# EasyEDA Pro project 支架带LED板_倒.eprj

# Schematic Schematic1
Create Date: 2024-05-26; Page Name: P1; Project Name: 支架带LED板_倒; Schematic Name: Schematic1; Update Date: 2024-05-27; Company: 嘉立创EDA; Page Size: A4; Version: V1.0
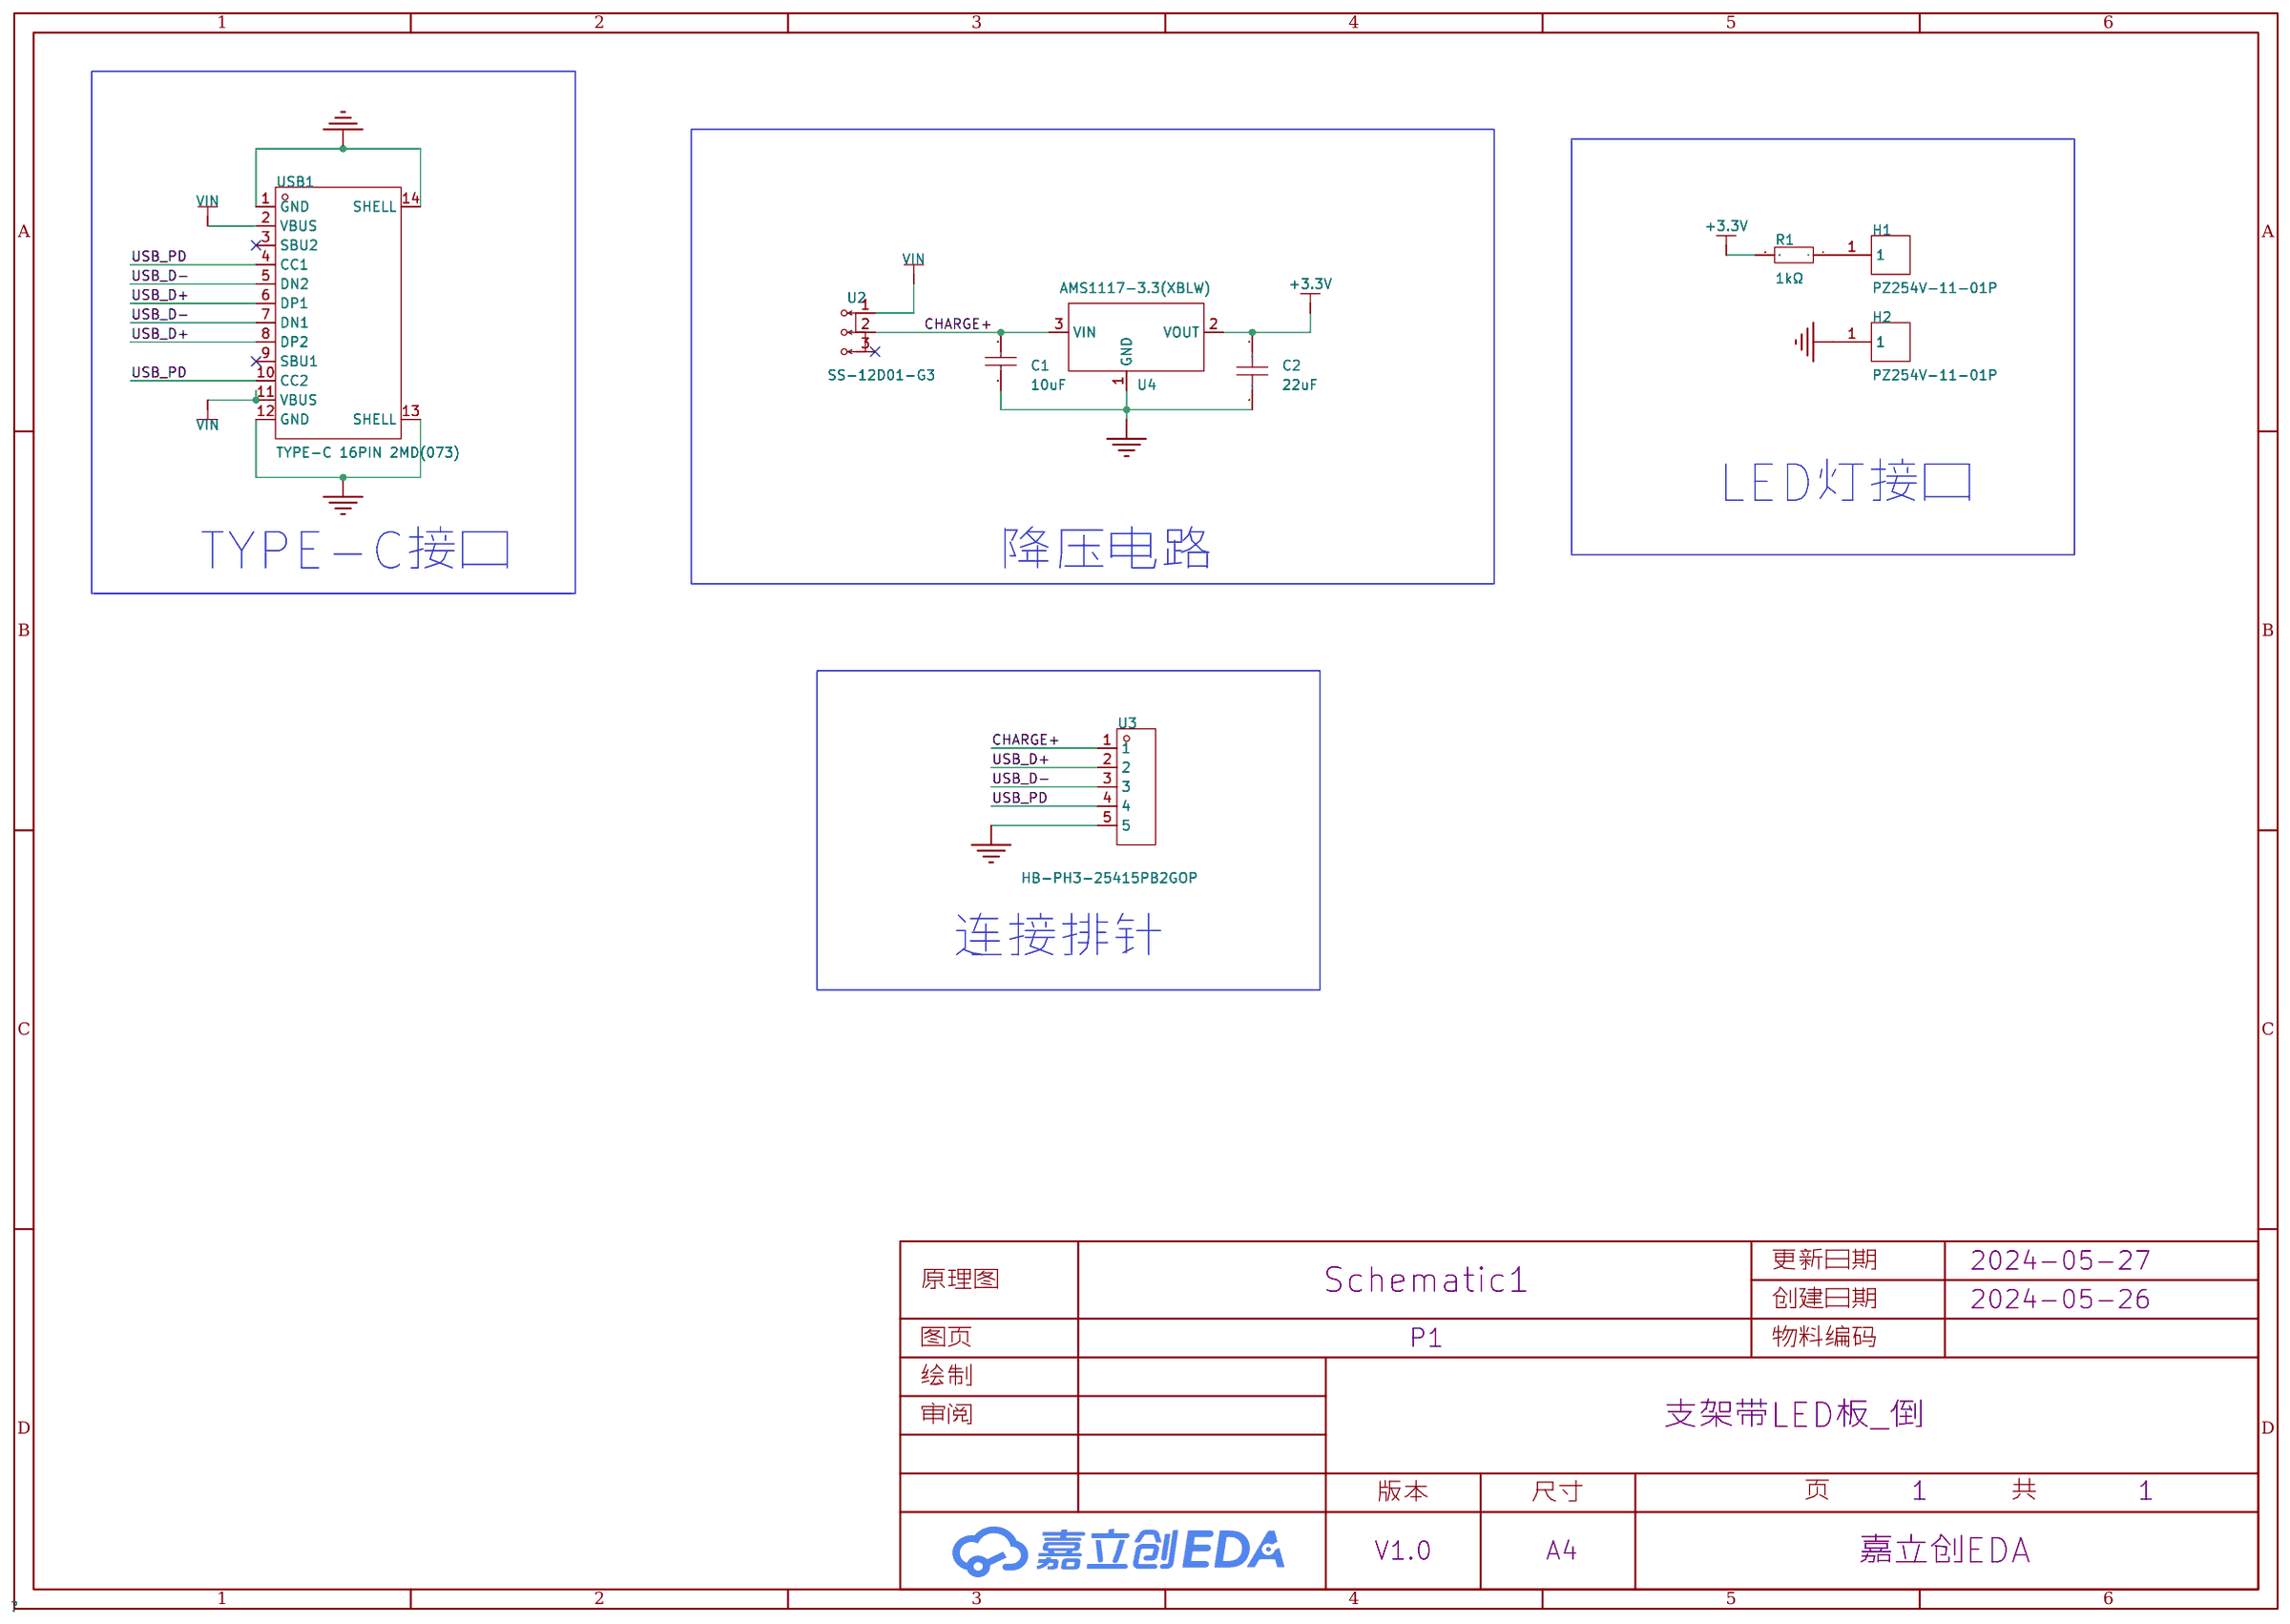
[diagram p0: schematic sheet]

## Parts
C1  10uF  [C1210]
C2  22uF  [C0603]
H1  PZ254V-11-01P  [HDR-TH_1P-P2.54-V-M]
H2  PZ254V-11-01P  [HDR-TH_1P-P2.54-V-M]
R1  1kΩ  [R0805]
U2  SS-12D01-G3  [SW-TH_DEALON_SS-12D01-GX]
U3  HB-PH3-25415PB2GOP  [HDR-TH_5P-P2.54-V-M]
U4  AMS1117-3.3(XBLW)  [SOT-89-3_L4.5-W2.5-P1.50-LS4.2-BR]
USB1  TYPE-C 16PIN 2MD(073)  [USB-C-SMD_TYPE-C-6PIN-2MD-073]

## Library data of the parts
C1 = 1210B106K500NT_C116808: 容值:10uF;精度:±10%;额定电压:50V;材质(温度系数):X7R;; LCSC Part Name: 10uF ±10% 50V; Supplier Part: C116808; Manufacturer: FH(风华); Manufacturer Part: 1210B106K500NT; Supplier Footprint: 1210; JLCPCB Part Class: 扩展库; Datasheet: https://atta.szlcsc.com/upload/public/pdf/source/20200305/C486355_26A10D38EF8C2A5C37091D0039909270.pdf; Supplier: LCSC; Tolerance: ±10%; Voltage Rated: 50V; Temperature Coefficient: X7R
C2 = CL10A226MQ8NRNC: 容值:22uF;精度:±20%;额定电压:6.3V;材质(温度系数):X5R;; LCSC Part Name: 22uF ±20% 6.3V; Supplier Part: C59461; Manufacturer: SAMSUNG(三星); Supplier Footprint: 0603; JLCPCB Part Class: 基础库; Datasheet: https://atta.szlcsc.com/upload/public/pdf/source/20160218/1457707763339.pdf; Supplier: LCSC; Tolerance: ±20%; Voltage Rated: 6.3V; Temperature Coefficient: X5R
H1 H2 = PZ254V-11-01P: 插针结构:1x1P;间距:2.54mm;行距:-;圆针/方针:方针;安装类型:直插;排数:单排;总PIN位数:1P;额定电流:-;额定电压:-;配合针长度:6mm;塑高:2.5mm;端接针长度:3mm;触头材质:黄铜;触头镀层:-;工作温度范围:-40℃~+105℃;颜色:黑色;; LCSC Part Name: 间距:2.54mm 1x1P 直插 方针; Supplier Part: C492400; Manufacturer: XFCN(兴飞); Supplier Footprint: 插件,P=2.54mm; JLCPCB Part Class: 扩展库; Datasheet: https://atta.szlcsc.com/upload/public/pdf/source/20200309/C492400_46876A5B545F5AE6B8D4A09C46E276E8.pdf; Supplier: LCSC; Pin Structure: 1x1P; Pitch: 2.54mm; Circluar Pins/Square Pins: 方针; Mounting Type: 直插; Number of Rows: 单排; Number of Pins: 1P; Length of Mating Pin: 6mm; Insulation Height: 2.5mm; Length of End Connection Pin: 3mm; Contact Material: 黄铜; Operating Temperature Range: -40℃~+105℃; Color: 黑色
R1 = RC0805FR-071KL: 电阻类型:厚膜电阻;阻值:1kΩ;精度:±1%;功率:125mW;最大工作电压:150V;温度系数:±100ppm/℃;; LCSC Part Name: 厚膜电阻 1kΩ ±1% 125mW; Supplier Part: C95781; Manufacturer: YAGEO(国巨); Supplier Footprint: 0805; JLCPCB Part Class: 扩展库; Datasheet: https://atta.szlcsc.com/upload/public/pdf/source/20170708/1499509500945.pdf; Supplier: LCSC; Type: 厚膜电阻; Tolerance: ±1%; Power(Watts): 125mW; Overload Voltage (Max): 150V; Temperature Coefficient: ±100ppm/℃; Operating Temperature Range: -55℃~+155℃
U2 = SS-12D01-G3_C2998803: 电路结构:单刀双掷;安装方式:直插;开关颜色:黑色;机械寿命:-;; Supplier Part: C2998803; Manufacturer: DEALON(德艺隆); Supplier Footprint: 插件; JLCPCB Part Class: 扩展库; Datasheet: https://atta.szlcsc.com/upload/public/pdf/source/20220425/25A884465C8B20C5829C01117852840B.pdf; Supplier: LCSC; Circuit: 单刀双掷; Actuator Style: 矩形柱状; Pin Style: PC引脚; Switch Length: 8.5mm; Switch Width: 3.8mm; Mounting Style: 直插; Actuator Color: 黑色
U3 = HB-PH3-25415PB2GOP: 插针结构:1x5P;间距:2.54mm;行距:2.54mm;圆针/方针:方针;安装类型:直插;排数:单排;总PIN位数:5P;额定电流:3A;额定电压:250V;配合针长度:6mm;塑高:2.54mm;端接针长度:3mm;触头材质:黄铜;触头镀层:金;工作温度范围:-40℃~+105℃;焊接温度(最大值):260℃;颜色:黑色;; LCSC Part Name: 间距:2.54mm 1x5P 直插 方针; Supplier Part: C6332198; Manufacturer: HANBO(汉博); Supplier Footprint: 插件,P=2.54mm; JLCPCB Part Class: 扩展库; Datasheet: https://atta.szlcsc.com/upload/public/pdf/source/20230803/F72D259687963761DF1B552F3BB84A31.pdf; Supplier: LCSC; Pin Structure: 1x5P; Pitch: 2.54mm; Row Spacing: 2.54mm; Circluar Pins/Square Pins: 方针; Mounting Type: 直插; Number of Rows: 单排; Number of Pins: 5P; Current Rating (Max): 3A; Voltage Rating (Max): 250V; Length of Mating Pin: 6mm; Insulation Height: 2.54mm; Length of End Connection Pin: 3mm; Contact Material: 黄铜; Contact Plating: 金; Operating Temperature Range: -40℃~+105℃; Soldering Temperature(Max): 260℃; Color: 黑色
U4 = AMS1117-3.3(XBLW): 最大输入电压:15V;最大输出电流:1A;; LCSC Part Name: AMS1117-3.3; Supplier Part: C18723569; Manufacturer: XBLW(芯伯乐); Supplier Footprint: SOT-89; JLCPCB Part Class: 扩展库; Datasheet: https://atta.szlcsc.com/upload/public/pdf/source/20231019/F4230EEFC48908FC91962BB59ACA9AD6.pdf; Supplier: LCSC; Maximum Input Voltage: 15V; MAX Output Current: 1A
USB1 = TYPE-C 16PIN 2MD(073): 连接器类型:Type-C;标准:-;公母:母;端口数量:1;触点数量:16P;安装方式:卧贴;额定电流 - 电源:5A;工作温度范围:-25℃~+85℃;; LCSC Part Name: Type-C 母 卧贴; Supplier Part: C2765186; Manufacturer: SHOU HAN(首韩); Supplier Footprint: SMD; JLCPCB Part Class: 扩展库; Datasheet: https://atta.szlcsc.com/upload/public/pdf/source/20211123/39B17C16241EAC15C5E277BDA434118E.pdf; Supplier: LCSC; Connector Type: Type-C; Gender: 母; Number of Ports: 1; Number of Contacts: 16P; Mounting Style: 卧贴; Current Rating - Power (Max): 5A; Operating Temperature Range: -25℃~+85℃

## Nets
+3.3V: C2.2 R1.2 U4.2(VOUT)
GND: C1.1 C2.1 H2.1 U3.5 U4.1(GND) USB1.1(GND) USB1.12(GND) USB1.13(SHELL) USB1.14(SHELL)
VIN: U2.1 USB1.2(VBUS) USB1.11(VBUS)
CHARGE+: C1.2 U2.2 U3.1 U4.3(VIN)
USB_D+: U3.2 USB1.6(DP1) USB1.8(DP2)
USB_D-: U3.3 USB1.5(DN2) USB1.7(DN1)
USB_PD: U3.4 USB1.4(CC1) USB1.10(CC2)
$1N2530: H1.1 R1.1

Not connected (* = marked no-connect by the designer): U2 3*; USB1 3(SBU2)* 9(SBU1)*

## Notes on the sheet
- LED灯接口
- TYPE-C接口
- 降压电路
- 连接排针

# Board PCB2
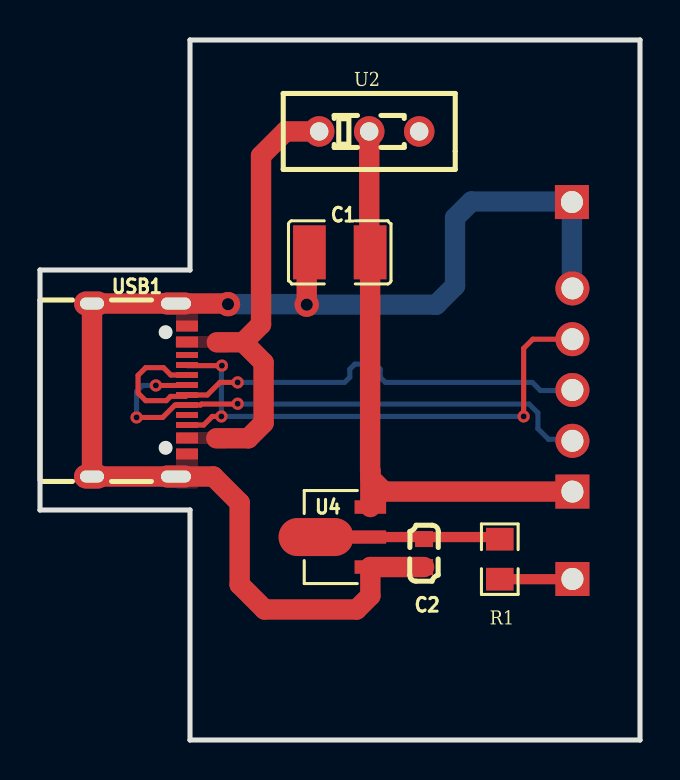
[diagram p1: board, top side]
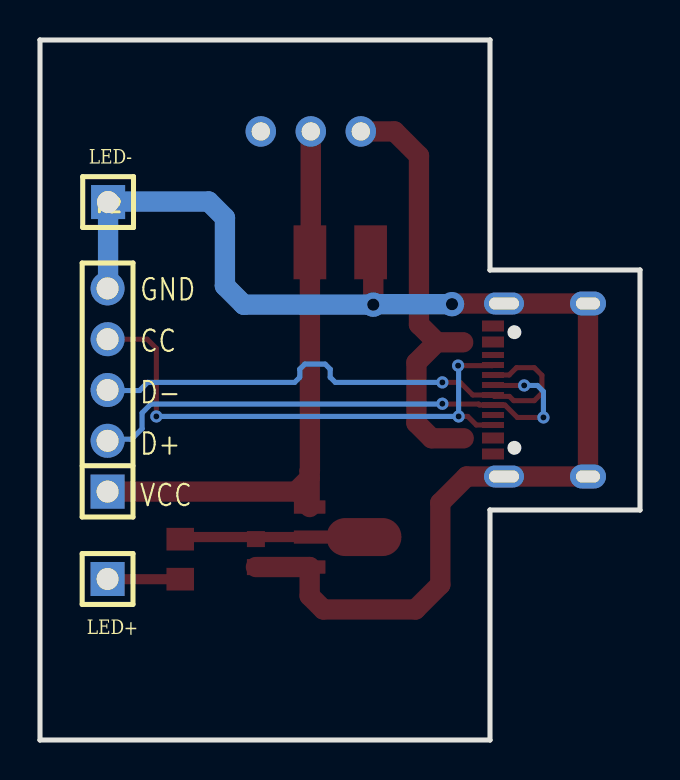
[diagram p2: board, bottom side, seen from below]

Outline 30 x 35 mm; copper layers: Top Layer, Bottom Layer. Coordinates in mm from the lower left corner of the outline.
Outline path: 0,23.5 0,11.5 7.5,11.5 7.5,0 30,0 30,35 7.5,35 7.5,23.5 0,23.5
Stack: Top Layer 0.035mm - / Dielectric1 1.11mm FR4 er 4.5 / Bottom Layer 0.035mm -

## Design rules (mm)
net USB_D-: DP1
net USB_D+: DP1
template: JLCPCB Capability(Two Layers Board)
spacing copperThickness1oz (default): track to track 0.102, other pairs 0.152 to 0.3
spacing copperThickness2oz: track to track 0.203, other pairs 0.152 to 0.3
track width copperThickness1oz (default): min 0.127, default 0.254, max 2.54
track width copperThickness2oz: min 0.203, default 0.254, max 2.54
differential pair differentialPair (default): width min 0.127, default 0.254, max 2.54; gap min 0.152, default 0.152
via viaSize (default): diameter min 0.5, default 0.61, max 10; hole min 0.3, default 0.305, max 6.3

## Placement (name value [footprint] x y rotation side)
C1  10uF  [C1210]  14.99 24.38 0 top
C2  22uF  [C0603]  19.2 9.35 90 top
H1  PZ254V-11-01P  [HDR-TH_1P-P2.54-V-M]  26.62 8.05 270 bottom
H2  PZ254V-11-01P  [HDR-TH_1P-P2.54-V-M]  26.6 26.9 90 bottom
R1  1kΩ  [R0805]  22.99 9.04 90 top
U2  SS-12D01-G3  [SW-TH_DEALON_SS-12D01-GX]  16.46 30.43 0 top
U3  HB-PH3-25415PB2GOP  [HDR-TH_5P-P2.54-V-M]  26.62 17.5 90 bottom
U4  AMS1117-3.3(XBLW)  [SOT-89-3_L4.5-W2.5-P1.50-LS4.2-BR]  15.16 10.15 0 top
USB1  TYPE-C 16PIN 2MD(073)  [USB-C-SMD_TYPE-C-6PIN-2MD-073]  4.98 17.5 270 top

## Footprints (pads in the part's own frame, mm; a bottom-side part is the same pattern mirrored in y, then rotated)
C0603
  rect 0.8x0.9 smd: 1(-0.7,0) 2(0.7,0)
C1210
  rect 1.635x2.7 smd: 1(-1.518,0) 2(1.518,0)
HDR-TH_1P-P2.54-V-M
  rect 1.7x1.7 hole 1.1: 1(0,0)
HDR-TH_5P-P2.54-V-M
  rect 1.7x1.7 hole 1.1: 1(-5.08,0)
  round 1.7 hole 1.1: 2(-2.54,0) 3(0,0) 4(2.54,0) 5(5.08,0)
R0805
  rect 1.133x1.377 smd: 1(-1,0) 2(1,0)
SOT-89-3_L4.5-W2.5-P1.50-LS4.2-BR
  rect 1.575x0.672 smd: 1(1.356,-1.5) 3(1.356,1.5)
  custom 5.377x1.9 smd: 2(-1.356,0)
SW-TH_DEALON_SS-12D01-GX
  round 1.524 hole 0.914: 1(-2.5,0) 2(0,0) 3(2.5,0)
USB-C-SMD_TYPE-C-6PIN-2MD-073
  rect 0.55x1.1 smd: 1(-3.2,2.375) 2(-2.4,2.375) 11(2.4,2.375) 12(3.2,2.375)
  rect 0.3x1.1 smd: 3(-1.75,2.375) 4(-1.25,2.375) 5(-0.75,2.375) 6(-0.25,2.375) 7(0.25,2.375) 8(0.75,2.375) 9(1.25,2.375) 10(1.75,2.375)
  oval 1.1x2 hole 0.6x1.5: 13(-4.325,1.825) 14(4.325,1.825)
  oval 1.2x1.8 hole 0.6x1.2: 13(-4.325,-2.375) 14(4.325,-2.375)

## Nets
As in the schematic.

Pads without a net: U2 3; USB1 3 9

## Via types
v1: diameter 0.61, hole 0.305, Top Layer to Bottom Layer, 8 vias
v2: diameter 1.219, hole 0.61, Top Layer to Bottom Layer, 2 vias

## Routing (per net, layer and track width the routed paths; a pad name or vN(x,y) marks a point on that pad's centre or on a via; arc(x,y) is an arc through that point)
+3.3V: length 9.2
  Top Layer w0.508: R1.2 22.88,10.15 U4.2
GND: length 66.8
  Top Layer w1.016: C2.1 U4.1 16.52,7.21 15.83,6.53 11.23,6.53 9.98,7.77 9.98,11.86 8.67,13.17 USB1.14 USB1.14 USB1.13 USB1.13 9.37,21.83 v2(9.4,21.79) ; v2(13.34,21.77) 13.34,23.84 13.47,23.98
  Bottom Layer w1.016: v2(9.4,21.79) 13.31,21.79 ; U3.5 26.6,22.61 H2.1 26.57,26.92 21.57,26.92 20.75,26.11 20.75,22.71 19.81,21.77 v2(13.34,21.77)
VIN: length 21.6
  Top Layer w1.016: 10.16,19.89 11.05,20.78 11.05,29.21 12.27,30.43 U2.1 ; 10.16,19.89 8.84,19.89 ; 10.16,19.89 11.18,18.87 11.18,15.85 10.42,15.09 8.82,15.09
CHARGE+: length 29.2
  Top Layer w1.016: 16.52,13.1 16.52,13.45 16.51,13.46 16.51,23.98 16.46,24.02 U2.2 ; 16.52,13.1 U4.3 ; 16.52,13.1 17.2,12.42 U3.1
USB_D+: length 27.3
  Top Layer w0.254: v1(9.88,16.81) 9.87,16.8 8.07,16.8 8.03,16.75 USB1.8 6.76,16.75 6.13,16.13 v1(4.83,16.13) ; USB1.6 7.33,17.73 v1(5.79,17.73)
  Bottom Layer w0.254: v1(9.88,16.81) 9.9,16.8 24.45,16.8 24.89,16.36 24.89,15.57 25.43,15.04 26.55,15.04 U3.2 ; v1(4.83,16.13) 4.83,17.42 5.13,17.73 v1(5.79,17.73)
USB_D-: length 27.3
  Top Layer w0.254: USB1.5 6.54,18.25 6.17,18.62 5.28,18.62 4.9,18.24 4.9,17.35 5.28,16.97 6.31,16.97 6.53,17.18 7.28,17.18 USB1.7 8.36,17.25 8.99,17.88 v1(9.88,17.88)
  Bottom Layer w0.254: v1(9.88,17.88) 15.24,17.88 15.49,18.13 15.49,18.54 15.74,18.8 16.76,18.8 17.01,18.54 17.01,18.13 17.27,17.88 24.61,17.88 25.02,17.47 26.59,17.47 U3.3
USB_PD: length 27.4
  Top Layer w0.254: v1(24.18,16.18) 24.18,19.58 24.64,20.04 U3.4 ; v1(9.07,16.18) 8.61,16.18 8.18,15.75 USB1.10 ; v1(9.09,18.72) 7.38,18.72 USB1.4
  Bottom Layer w0.254: v1(24.18,16.18) v1(9.07,16.18) 9.07,18.69 v1(9.09,18.72)
$1N2530: length 3.6
  Top Layer w0.508: H1.1 26.61,8.04 R1.1

## Copper pours and planes (outline as drawn; the poured copper is in the pictures)
GND on Top Layer: 6.8,22.31 7.9,22.31 7.9,20.42 6.8,20.42
GND on Top Layer: 6.8,14.58 7.9,14.58 7.9,12.57 6.8,12.57
VIN on Top Layer: 6.78,20.39 9.44,20.39 9.44,19.38 6.78,19.38
VIN on Top Layer: 6.8,15.59 9.37,15.59 9.37,14.58 6.8,14.58

## Text on the board
Bottom Silkscreen Layer: GND | CC | D- | D+ | VCC | LED- | LED+
